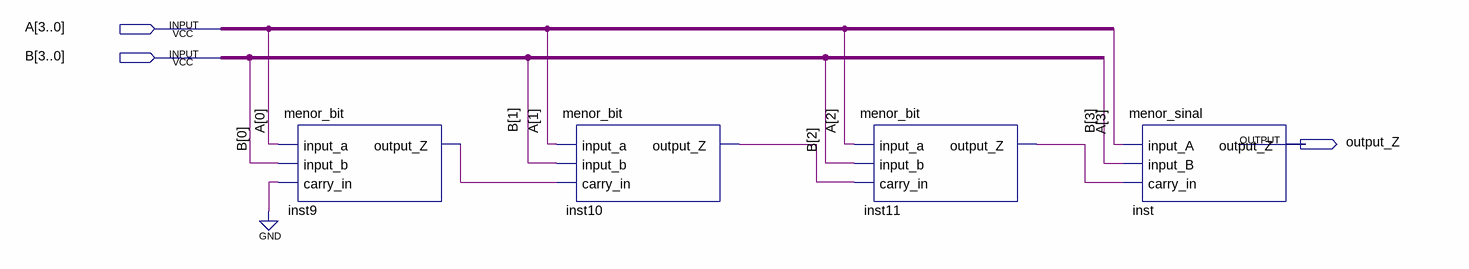
[diagram p0: schematic sheet]
// Quartus schematic compare_less.bdf as structural Verilog: 4 symbols, 3 pins
module compare_less (
  input  [3:0] A,
  input  [3:0] B,
  output output_Z
);

  wire inst9_output_z, inst10_output_z, inst11_output_z;

  menor_bit inst9 (.input_a(A[0]), .input_b(B[0]), .carry_in(1'b0), .output_Z(inst9_output_z));
  menor_bit inst10 (.input_a(A[1]), .input_b(B[1]), .carry_in(inst9_output_z), .output_Z(inst10_output_z));
  menor_bit inst11 (.input_a(A[2]), .input_b(B[2]), .carry_in(inst10_output_z), .output_Z(inst11_output_z));
  menor_sinal inst (.input_A(A[3]), .input_B(B[3]), .carry_in(inst11_output_z), .output_Z(output_Z));
endmodule
